# EAGLE design LB_BIT_2IN_1OUT-LARGE-v03(1_1x) (EAGLE 6.5.0)
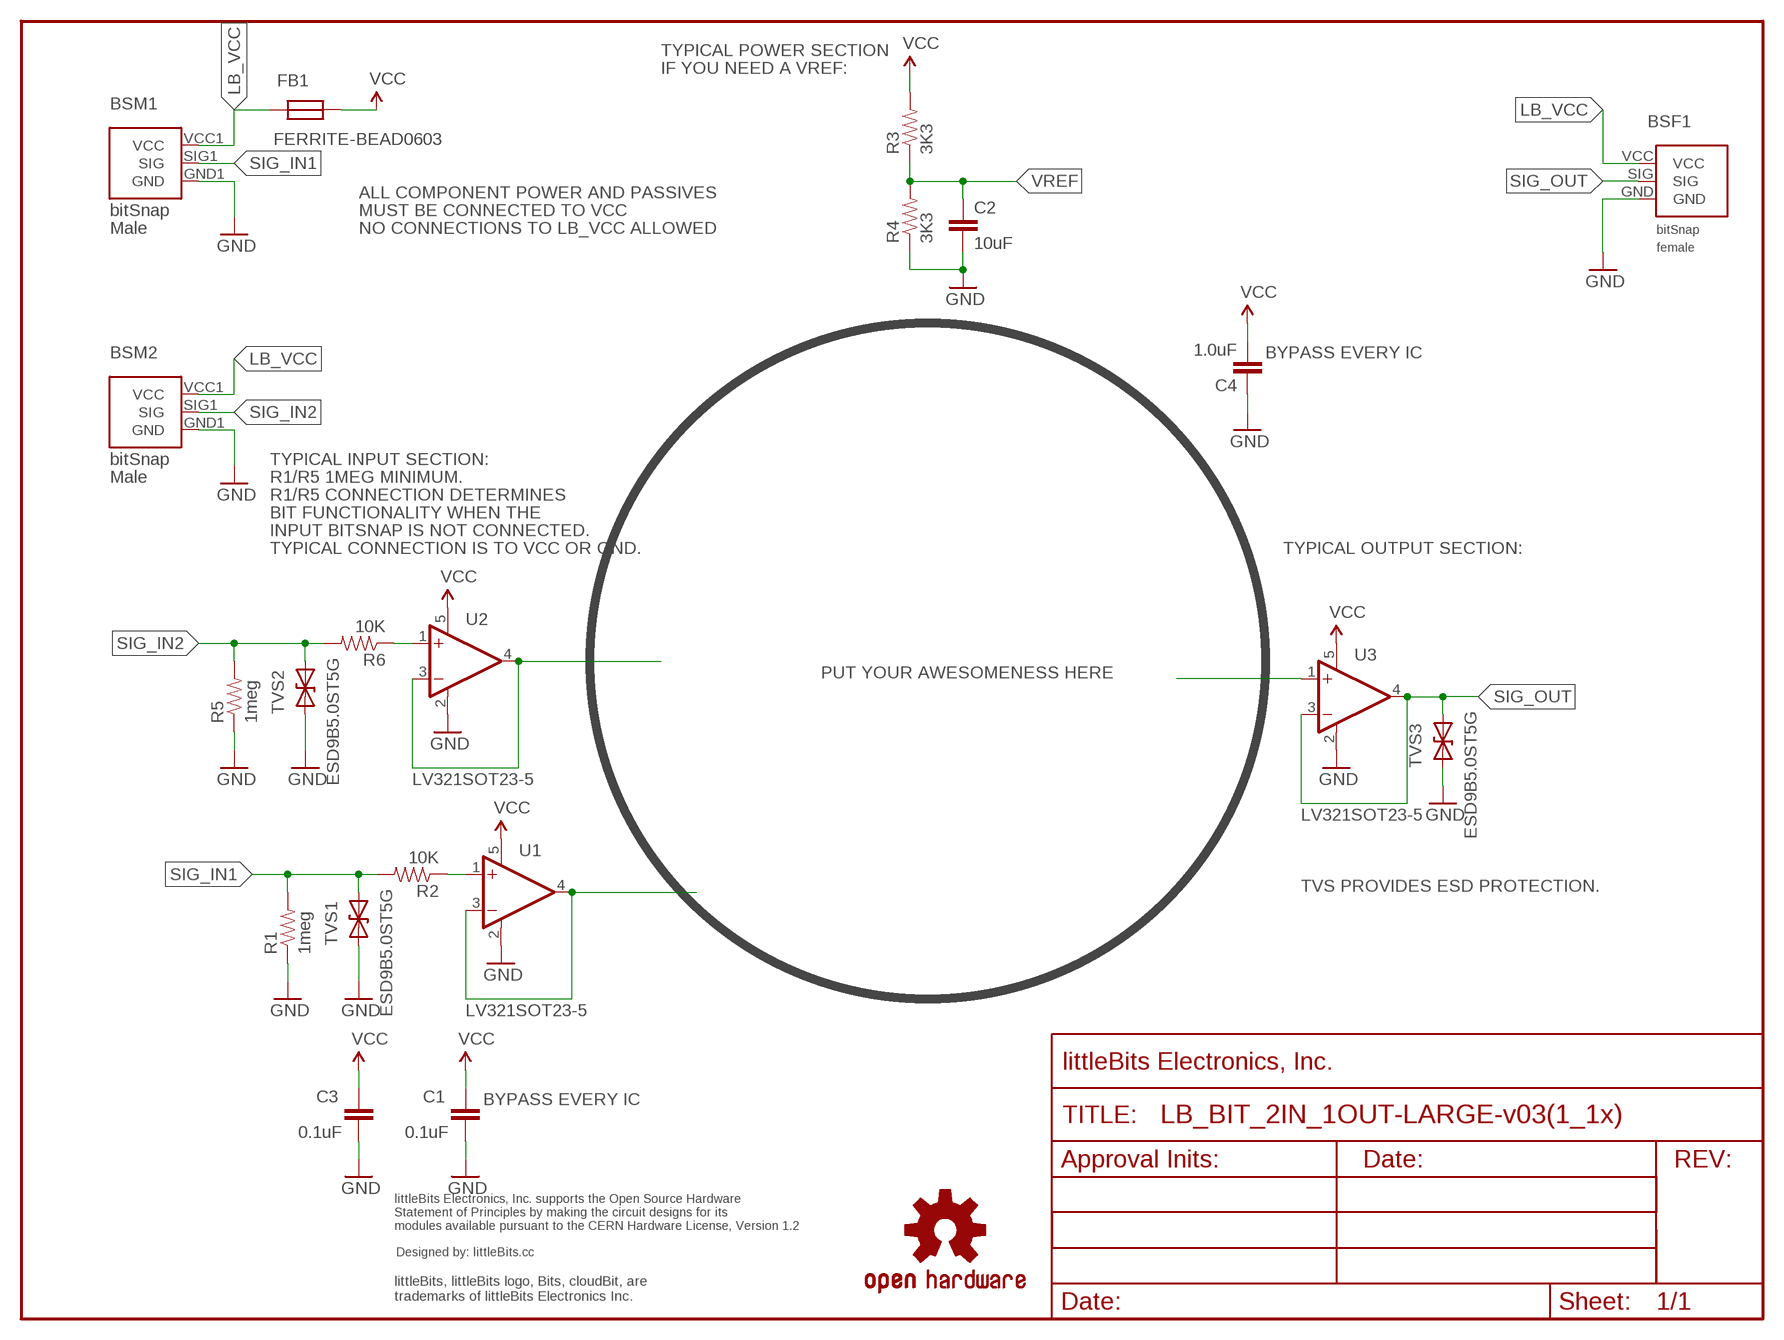
[diagram p0: schematic, sheet 1]

## Parts
BSF1  BITSNAP_V03_FEMALE  [BITSNAP_V03_FEMALE]
BSM1  BITSNAP_V03_MALE  [BITSNAP_V03_MALE]
BSM2  BITSNAP_V03_MALE  [BITSNAP_V03_MALE]
C1  0.1uF  CAPCAP-0603  [CAP-0603]
C2  10uF  CAPCAP-0603  [CAP-0603]
C3  0.1uF  CAPCAP-0603  [CAP-0603]
C4  1.0uF  CAPCAP-0603  [CAP-0603]
FB1  FERRITE-BEAD0603  [R0603]
FRAME1  FRAME-LETTER  [FABDWG01-OHW]
R1  1meg  RESISTOR0603  [RES-0603]
R2  10K  RESISTOR0603  [RES-0603]
R3  3K3  RESISTOR0603  [RES-0603]
R4  3K3  RESISTOR0603  [RES-0603]
R5  1meg  RESISTOR0603  [RES-0603]
R6  10K  RESISTOR0603  [RES-0603]
TVS1  ESD9B5.0ST5G  DIODE-TVSSOD-923  [SOD-923]
TVS2  ESD9B5.0ST5G  DIODE-TVSSOD-923  [SOD-923]
TVS3  ESD9B5.0ST5G  DIODE-TVSSOD-923  [SOD-923]
U1  LV321SOT23-5  [SOT23-5]
U2  LV321SOT23-5  [SOT23-5]
U3  LV321SOT23-5  [SOT23-5]
U$1  OSHWCREDIT  [OSHWCREDIT]
U$2  OSHW-LOGOL  [OSHW-LOGO-L]

## Nets
GND: BSF1.GND BSM1.GND1(GND) BSM2.GND1(GND) C1.2 C2.2 C3.2 C4.1 R1.1 R4.1 R5.1 TVS1.1(A) TVS2.1(A) TVS3.1(A) U1.2(V-) U2.2(V-) U3.2(V-)
LB_VCC: BSF1.VCC BSM1.VCC1(VCC) BSM2.VCC1(VCC) FB1.2
N$1: U2.3(-IN) U2.4(OUT)
N$2: R6.1 U2.1(+IN)
N$3: U1.3(-IN) U1.4(OUT)
N$4: R2.1 U1.1(+IN)
N$12: U3.1(+IN)
SIG_IN1: BSM1.SIG1(SIG) R1.2 R2.2 TVS1.2(C)
SIG_IN2: BSM2.SIG1(SIG) R5.2 R6.2 TVS2.2(C)
SIG_OUT: BSF1.SIG TVS3.2(C) U3.3(-IN) U3.4(OUT)
VCC: C1.1 C3.1 C4.2 FB1.1 R3.2 U1.5(V+) U2.5(V+) U3.5(V+)
VREF: C2.1 R3.1 R4.2

## Notes on the sheet
- TYPICAL POWER SECTION
- IF YOU NEED A VREF:
- ALL COMPONENT POWER AND PASSIVES
- MUST BE CONNECTED TO VCC
- NO CONNECTIONS TO LB_VCC ALLOWED
- BYPASS EVERY IC
- TYPICAL INPUT SECTION:
- R1/R5 1MEG MINIMUM.
- R1/R5 CONNECTION DETERMINES
- BIT FUNCTIONALITY WHEN THE
- INPUT BITSNAP IS NOT CONNECTED.
- TYPICAL CONNECTION IS TO VCC OR GND. | TYPICAL OUTPUT SECTION:
- PUT YOUR AWESOMENESS HERE
- TVS PROVIDES ESD PROTECTION.
- BYPASS EVERY IC

## Library data of the parts
BSF1 = bitSnap:BITSNAP_V03_FEMALE
BSM1 BSM2 = bitSnap:BITSNAP_V03_MALE
C1-C4 = LITTLEBITS:CAP
FB1 = LITTLEBITS:FERRITE-BEAD
FRAME1 = LITTLEBITS:FRAME-LETTER
R1-R6 = LITTLEBITS:RESISTOR
TVS1-TVS3 = LITTLEBITS:DIODE-TVS: Bidirectional Transient Voltage Suppression Diode: Device conducts in avalanche mode after reaching a part dependent voltage threshold. Used for limiting voltage spikes on ESD sensitive inputs and outputs.; IEC_ESD_PROT0: +/-18kV; LB_PN: ?; MPN: ESD9B5.0ST5G; V_CLAMP: ?; V_OPERATION: 5V
U1-U3 = LITTLEBITS:LV321
U$1 = LITTLEBITS:OSHWCREDIT
U$2 = SparkFun_NEW:OSHW-LOGO: Open Source Hardware Logo This logo indicates the piece of hardware it is found on incorporates a OSHW license and/or adheres to the definition of open source hardware found here: http://freedomdefined.org/OSHW

## Board
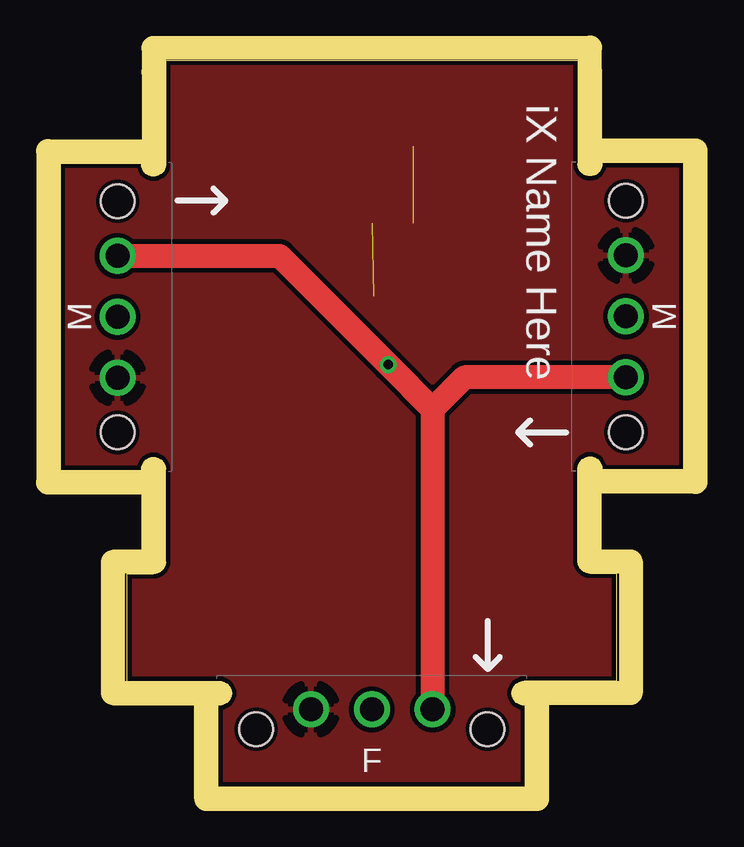
[diagram p1: board, top side]
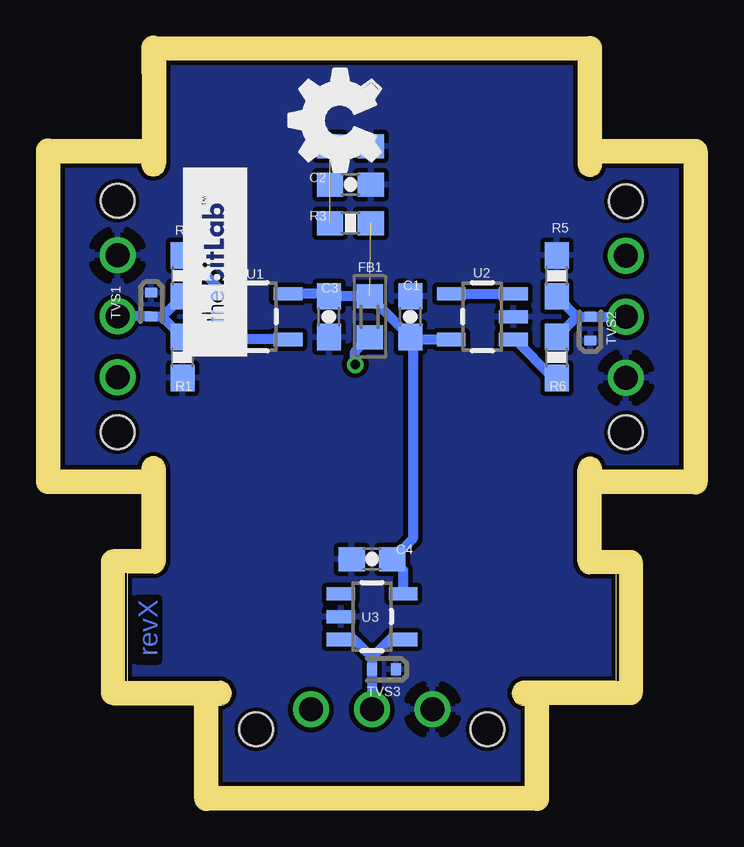
[diagram p2: board, bottom side, seen from below]

Size 26 x 30.29 mm. Coordinates in mm from the lower left corner, seen from the top.
Outline: 2.8,4.4 2.8,8.88 3.9,8.88 arc90 4.4,9.38 4.4,9.38
Outline: 23.2,4.4 23.2,8.89 22.1,8.89 arc-90 21.6,9.39 21.6,9.4
Outline: 4.4,29.79 4.4,30.29 21.6,30.29 21.6,29.8
Copper layers (1*16): Top 0.035mm / dielectric 1.5mm / Bottom 0.035mm
Design rules "littleBitsDRC": minimum track width 0.2mm, minimum drill 0.4mm, track to track 0.2mm, track to pad 0.2mm, pad to pad 0.2mm, via to via 0.2mm, smd to smd 0mil, copper to edge 0.2mm, drill to drill 0.2mm, minimum pad ring 0.2mm, minimum via ring 0.15mm, stop-mask expansion 0.1mm, vias tented up to drill 0mil, thermal gap 0.2mm
Milling: 9 lines

### Footprints (pad centres in the part's own frame; a part is rotated, then mirrored left to right if it is on the bottom)
BITSNAP_V03_FEMALE = drill 1: GND 4.065,3.44; SIG 6.605,3.44; VCC 9.145,3.44 | hole 1.4: 1.785,2.61; 11.425,2.61
BITSNAP_V03_MALE = drill 1: GND1 9.145,2.61; SIG1 6.605,2.61; VCC1 4.065,2.61 | hole 1.4: 1.785,2.61; 11.425,2.61
CAP-0603 = smd 1.1 x 1: 1 -0.85,0; 2 0.85,0
R0603 = smd 1 x 1.1: 1 -0.85,0; 2 0.85,0
RES-0603 = smd 1.1 x 1: 1 -0.85,0; 2 0.85,0
SOD-923 = smd 0.4 x 0.5: 1 -0.5,0; 2 0.5,0
SOT23-5 = smd 0.55 x 1.2: 1 -0.95,-1.3; 2 0,-1.3; 3 0.95,-1.3; 4 0.95,1.3; 5 -0.95,1.3

### Placement (x,y rotation side)
BSF1  6.4,-0.21 0 top
BSM1  26.21,13 90 top
BSM2  -0.21,26.19 270 top
C1  11.39,19.59 90 bottom
C2  13.89,25.09 0 bottom
C3  14.79,19.59 270 bottom
C4  12.99,9.49 0 bottom
FB1  13.09,19.59 270 bottom
FRAME1  -0.21,-0.21 0 top
R1  20.89,17.89 90 bottom
R2  20.89,21.29 270 bottom
R3  13.89,23.49 0 bottom
R4  13.89,26.69 180 bottom
R5  5.29,21.29 270 bottom
R6  5.29,17.89 90 bottom
TVS1  22.19,20.09 270 bottom
TVS2  3.89,19.09 90 bottom
TVS3  12.49,4.89 180 bottom
U1  17.79,19.59 270 bottom
U2  8.39,19.59 90 bottom
U3  12.99,7.09 270 bottom
U$1  -94.45,-62.63 0 top  (outside the outline)
U$2  -29.53,-69.17 0 top  (outside the outline)
U$3  [BITLAB-LOGO]  18.19,25.79 270 top
U$6  [OSHW_FILLX150_NOTEXT]  12.65,24.82 0 top

### Tracks (layer width: path | path; a pad name or v marks a point on that pad's centre or on a via)
GND
  pour Top: -0.11,30.59 26.19,30.59 26.19,-0.51 -0.11,-0.51
  pour Bottom: -0.11,30.59 26.19,30.59 26.19,-0.51 -0.11,-0.51
LB_VCC  (via drill 0.4)
  Top 1: BSM2.VCC1 9.15,22.12 v13.69,17.59 15.54,15.74 | 15.54,15.74 BSF1.VCC | BSM1.VCC1 16.86,17.06 15.54,15.74
  Bottom 0.406: FB1.2 13.69,18.14 v13.69,17.59
N$1
  Bottom 0.406: U2.4 U2.3
N$2
  Bottom 0.406: U2.1 7.04,18.64 5.44,17.04 R6.1
N$3
  Bottom 0.406: U1.4 U1.3
N$4
  Bottom 0.406: U1.1 19.14,20.54 20.74,22.14 R2.1
SIG_IN1
  Bottom 0.406: R2.2 21.74,19.59 | 21.74,19.59 TVS1.2 22.2,19.61 BSM1.SIG1 | R1.2 21.74,19.59
SIG_IN2
  Bottom 0.406: R5.2 4.44,19.59 | 4.44,19.59 TVS2.2 BSM2.SIG1 | R6.2 4.44,19.59
SIG_OUT
  Bottom 0.406: U3.4 12.24,6.14 12.99,5.39 | 12.99,5.39 TVS3.2 BSF1.SIG | U3.3 13.74,6.14 12.99,5.39
VCC  (1 unrouted)
  Bottom 0.406: U1.5 14.89,20.54 C3.1 FB1.1 C1.1 11.29,18.64 | 11.29,18.64 U2.5 | 11.29,18.64 11.29,10.34 C4.2 11.69,9.04 U3.5
VREF  (2 unrouted)

### Text on the board
Bottom: revX
tPlace: iX Name Here
Milling: 1mm DIA. ROUTER PATH